# Altium schematic sheet SWD.SchDoc
size A4; SheetNumber: 4; SheetTotal: 7
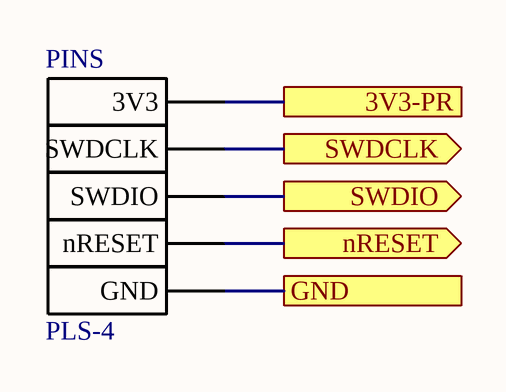
[diagram p0: SWD.SchDoc]

## Parts
PINS  PLS-4  [PLS-4 (DS-1021-1x4)]

## Ports
3V3-PR (see TOP_LEVEL[4A], MODULES[1C]), GND (see TOP_LEVEL[4B], FLASH[3C], MODULES[2D], NFC[2C], POWER_IN[3C], USB[3B]), nRESET (out, see TOP_LEVEL[4B], MODULES[3A]), SWDCLK (out, see TOP_LEVEL[4A], MODULES[3A]), SWDIO (out, see TOP_LEVEL[4B], MODULES[3A])

## Nets
3V3-PR: PINS.1(3V3) ; port 3V3-PR
GND: PINS.5(GND) ; port GND
nRESET: PINS.4(nRESET) ; port nRESET
SWDCLK: PINS.2(SWDCLK) ; port SWDCLK
SWDIO: PINS.3(SWDIO) ; port SWDIO

## Library data of the parts
PINS = PLS-4 (DS-1021-1x4)